# Altium schematic sheet fpga_ddr3l.SchDoc: FPGA DDR3L Memory
size A4; Organization: GPA Robotics; DocumentNumber: 4; Revision: REV 0; SheetNumber: 4; SheetTotal: 4
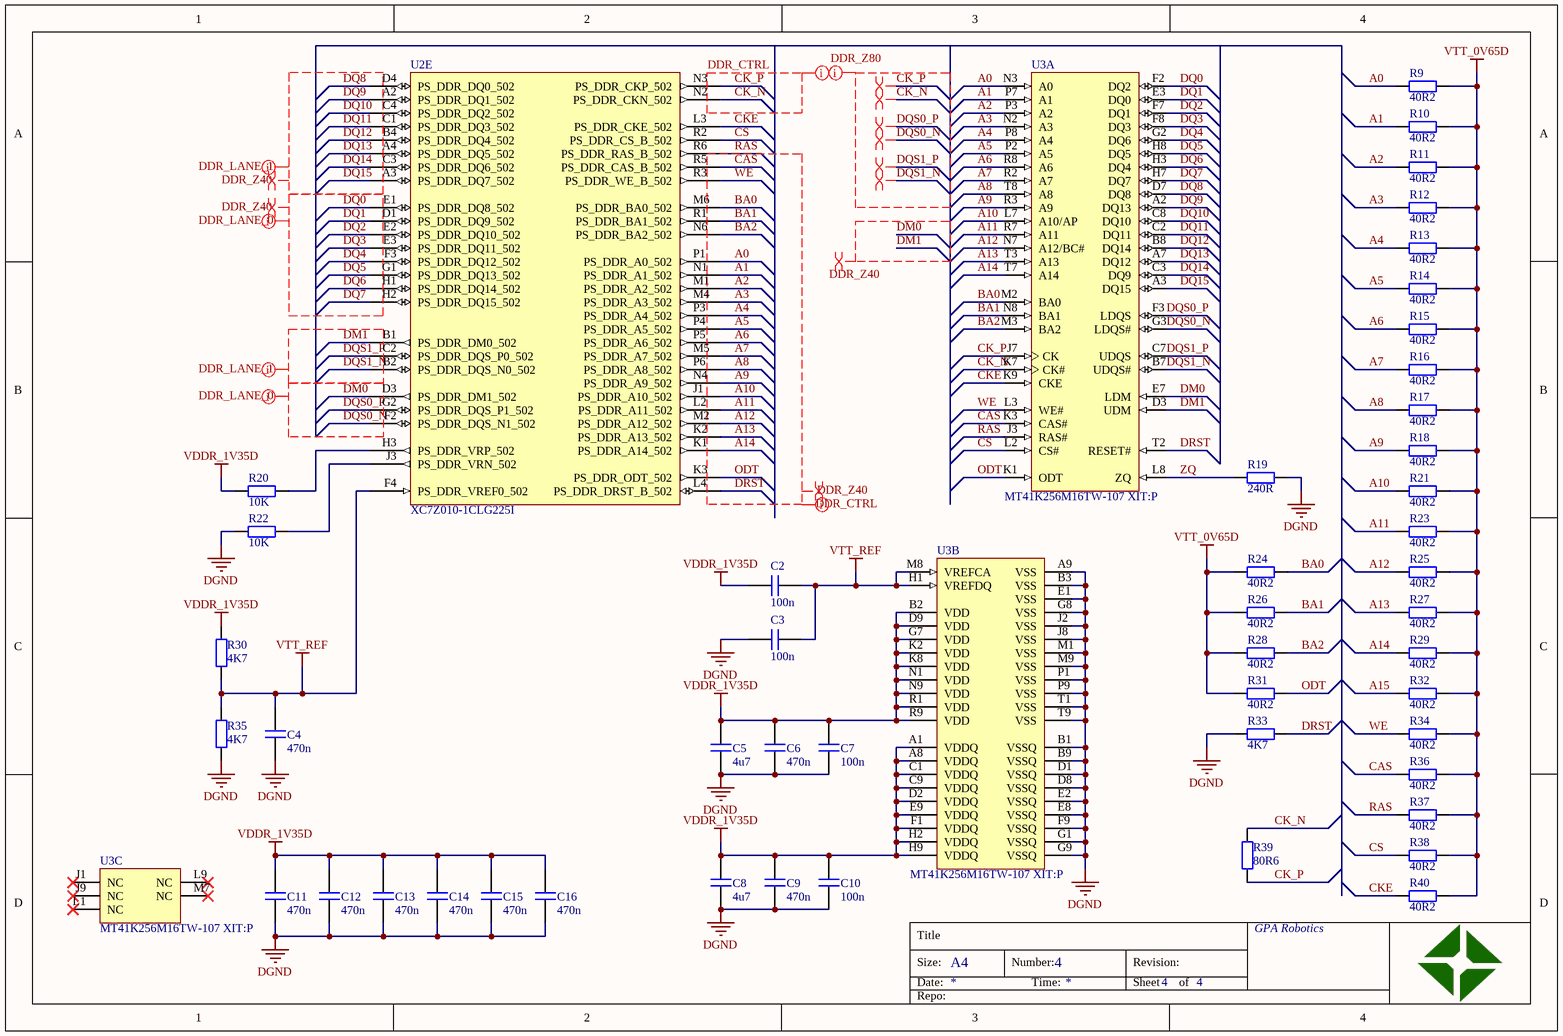
[diagram p0: fpga_ddr3l.SchDoc]

## Parts
C2  value 100n  [CAPC1005X06N]  (hidden comment: cap)
C3  value 100n  [CAPC1005X06N]  (hidden comment: cap)
C4  value 470n  [CAPC1005X06N]  (hidden comment: cap)
C5  value 4u7  [CAPC1608X08N]  (hidden comment: cap)
C6  value 470n  [CAPC1005X06N]  (hidden comment: cap)
C7  value 100n  [CAPC1005X06N]  (hidden comment: cap)
C8  value 4u7  [CAPC1608X08N]  (hidden comment: cap)
C9  value 470n  [CAPC1005X06N]  (hidden comment: cap)
C10  value 100n  [CAPC1005X06N]  (hidden comment: cap)
C11  value 470n  [CAPC1005X06N]  (hidden comment: cap)
C12  value 470n  [CAPC1005X06N]  (hidden comment: cap)
C13  value 470n  [CAPC1005X06N]  (hidden comment: cap)
C14  value 470n  [CAPC1005X06N]  (hidden comment: cap)
C15  value 470n  [CAPC1005X06N]  (hidden comment: cap)
C16  value 470n  [CAPC1005X06N]  (hidden comment: cap)
R9  value 40R2  [RESC1005X04N]  (hidden comment: res)
R10  value 40R2  [RESC1005X04N]  (hidden comment: res)
R11  value 40R2  [RESC1005X04N]  (hidden comment: res)
R12  value 40R2  [RESC1005X04N]  (hidden comment: res)
R13  value 40R2  [RESC1005X04N]  (hidden comment: res)
R14  value 40R2  [RESC1005X04N]  (hidden comment: res)
R15  value 40R2  [RESC1005X04N]  (hidden comment: res)
R16  value 40R2  [RESC1005X04N]  (hidden comment: res)
R17  value 40R2  [RESC1005X04N]  (hidden comment: res)
R18  value 40R2  [RESC1005X04N]  (hidden comment: res)
R19  value 240R  [RESC1005X04N]  (hidden comment: res)
R20  value 10K  [RESC1005X04N]  (hidden comment: res)
R21  value 40R2  [RESC1005X04N]  (hidden comment: res)
R22  value 10K  [RESC1005X04N]  (hidden comment: res)
R23  value 40R2  [RESC1005X04N]  (hidden comment: res)
R24  value 40R2  [RESC1005X04N]  (hidden comment: res)
R25  value 40R2  [RESC1005X04N]  (hidden comment: res)
R26  value 40R2  [RESC1005X04N]  (hidden comment: res)
R27  value 40R2  [RESC1005X04N]  (hidden comment: res)
R28  value 40R2  [RESC1005X04N]  (hidden comment: res)
R29  value 40R2  [RESC1005X04N]  (hidden comment: res)
R30  value 4K7  [RESC1005X04N]  (hidden comment: res)
R31  value 40R2  [RESC1005X04N]  (hidden comment: res)
R32  value 40R2  [RESC1005X04N]  (hidden comment: res)
R33  value 4K7  [RESC1005X04N]  (hidden comment: res)
R34  value 40R2  [RESC1005X04N]  (hidden comment: res)
R35  value 4K7  [RESC1005X04N]  (hidden comment: res)
R36  value 40R2  [RESC1005X04N]  (hidden comment: res)
R37  value 40R2  [RESC1005X04N]  (hidden comment: res)
R38  value 40R2  [RESC1005X04N]  (hidden comment: res)
R39  value 80R6  [RESC1005X04N]  (hidden comment: res)
R40  value 40R2  [RESC1005X04N]  (hidden comment: res)
U2  XC7Z010-1CLG225I  [CLG225]  (part E of 8)
U3  MT41K256M16TW-107 XIT:P  [MICT-TW-96]  (parts A,B,C of 3)

## Nets
DGND: C3.1 C4.1 C5.1 C6.1 C7.1 C8.1 C9.1 C10.1 C11.1 C12.1 C13.1 C14.1 C15.1 C16.1 R19.2 R22.1 R33.2 R35.1 U3.A9(VSS) U3.B1(VSSQ) U3.B3(VSS) U3.B9(VSSQ) U3.D1(VSSQ) U3.D8(VSSQ) U3.E1(VSS) U3.E2(VSSQ) U3.E8(VSSQ) U3.F9(VSSQ) U3.G1(VSSQ) U3.G8(VSS) U3.G9(VSSQ) U3.J2(VSS) U3.J8(VSS) U3.M1(VSS) U3.M9(VSS) U3.P1(VSS) U3.P9(VSS) U3.T1(VSS) U3.T9(VSS)
VDDR_1V35D: C2.1 C5.2 C6.2 C7.2 C8.2 C9.2 C10.2 C11.2 C12.2 C13.2 C14.2 C15.2 C16.2 R20.1 R30.2 U3.A1(VDDQ) U3.A8(VDDQ) U3.B2(VDD) U3.C1(VDDQ) U3.C9(VDDQ) U3.D2(VDDQ) U3.D9(VDD) U3.E9(VDDQ) U3.F1(VDDQ) U3.G7(VDD) U3.H2(VDDQ) U3.H9(VDDQ) U3.K2(VDD) U3.K8(VDD) U3.N1(VDD) U3.N9(VDD) U3.R1(VDD) U3.R9(VDD)
VTT_0V65D: R9.2 R10.2 R11.2 R12.2 R13.2 R14.2 R15.2 R16.2 R17.2 R18.2 R21.2 R23.2 R24.2 R25.2 R26.2 R27.2 R28.2 R29.2 R31.2 R32.2 R34.2 R36.2 R37.2 R38.2 R40.2
VTT_REF: C2.2 C3.2 C4.2 R30.1 R35.2 U2.F4(PS_DDR_VREF0_502) U3.H1(VREFDQ) U3.M8(VREFCA)
A0: R9.1 U2.P1(PS_DDR_A0_502) U3.N3(A0)
A1: R10.1 U2.N1(PS_DDR_A1_502) U3.P7(A1)
A2: R11.1 U2.M1(PS_DDR_A2_502) U3.P3(A2)
A3: R12.1 U2.M4(PS_DDR_A3_502) U3.N2(A3)
A4: R13.1 U2.P3(PS_DDR_A4_502) U3.P8(A4)
A5: R14.1 U2.P4(PS_DDR_A5_502) U3.P2(A5)
A6: R15.1 U2.P5(PS_DDR_A6_502) U3.R8(A6)
A7: R16.1 U2.M5(PS_DDR_A7_502) U3.R2(A7)
A8: R17.1 U2.P6(PS_DDR_A8_502) U3.T8(A8)
A9: R18.1 U2.N4(PS_DDR_A9_502) U3.R3(A9)
A10: R21.1 U2.J1(PS_DDR_A10_502) U3.L7(A10/AP)
A11: R23.1 U2.L2(PS_DDR_A11_502) U3.R7(A11)
A12: R25.1 U2.M2(PS_DDR_A12_502) U3.N7(A12/BC#)
A13: R27.1 U2.K2(PS_DDR_A13_502) U3.T3(A13)
A14: R29.1 U2.K1(PS_DDR_A14_502) U3.T7(A14)
A15: R32.1
BA0: R24.1 U2.M6(PS_DDR_BA0_502) U3.M2(BA0)
BA1: R26.1 U2.R1(PS_DDR_BA1_502) U3.N8(BA1)
BA2: R28.1 U2.N6(PS_DDR_BA2_502) U3.M3(BA2)
CAS: R36.1 U2.R5(PS_DDR_CAS_B_502) U3.K3(CAS#)
CK_N: R39.1 U2.N2(PS_DDR_CKN_502) U3.K7(CK#)
CK_P: R39.2 U2.N3(PS_DDR_CKP_502) U3.J7(CK)
CKE: R40.1 U2.L3(PS_DDR_CKE_502) U3.K9(CKE)
CS: R38.1 U2.R2(PS_DDR_CS_B_502) U3.L2(CS#)
DM0: U2.D3(PS_DDR_DM1_502) U3.E7(LDM)
DM1: U2.B1(PS_DDR_DM0_502) U3.D3(UDM)
DQ0: U2.E1(PS_DDR_DQ8_502) U3.F2(DQ2)
DQ1: U2.D1(PS_DDR_DQ9_502) U3.E3(DQ0)
DQ2: U2.E2(PS_DDR_DQ10_502) U3.F7(DQ1)
DQ3: U2.E3(PS_DDR_DQ11_502) U3.F8(DQ3)
DQ4: U2.F3(PS_DDR_DQ12_502) U3.G2(DQ6)
DQ5: U2.G1(PS_DDR_DQ13_502) U3.H8(DQ5)
DQ6: U2.H1(PS_DDR_DQ14_502) U3.H3(DQ4)
DQ7: U2.H2(PS_DDR_DQ15_502) U3.H7(DQ7)
DQ8: U2.D4(PS_DDR_DQ0_502) U3.D7(DQ8)
DQ9: U2.A2(PS_DDR_DQ1_502) U3.A2(DQ13)
DQ10: U2.C4(PS_DDR_DQ2_502) U3.C8(DQ10)
DQ11: U2.C1(PS_DDR_DQ3_502) U3.C2(DQ11)
DQ12: U2.B4(PS_DDR_DQ4_502) U3.B8(DQ14)
DQ13: U2.A4(PS_DDR_DQ5_502) U3.A7(DQ12)
DQ14: U2.C3(PS_DDR_DQ6_502) U3.C3(DQ9)
DQ15: U2.A3(PS_DDR_DQ7_502) U3.A3(DQ15)
DQS0_N: U2.F2(PS_DDR_DQS_N1_502) U3.G3(LDQS#)
DQS0_P: U2.G2(PS_DDR_DQS_P1_502) U3.F3(LDQS)
DQS1_N: U2.B2(PS_DDR_DQS_N0_502) U3.B7(UDQS#)
DQS1_P: U2.C2(PS_DDR_DQS_P0_502) U3.C7(UDQS)
DRST: R33.1 U2.L4(PS_DDR_DRST_B_502) U3.T2(RESET#)
ODT: R31.1 U2.K3(PS_DDR_ODT_502) U3.K1(ODT)
RAS: R37.1 U2.R6(PS_DDR_RAS_B_502) U3.J3(RAS#)
WE: R34.1 U2.R3(PS_DDR_WE_B_502) U3.L3(WE#)
ZQ: R19.1 U3.L8(ZQ)
NetR20_2: R20.2 U2.H3(PS_DDR_VRP_502)
NetR22_2: R22.2 U2.J3(PS_DDR_VRN_502)

Not connected (* = marked no-connect by the designer): U3 J1(NC)* J9(NC)* L1(NC)* L9(NC)* M7(NC)*

## Layout directives
net class DDR_CTRL: A0, A1, A2, A3, A4, A5, A6, A7, A8, A9, A10, A11, A12, A13, A14, BA0, BA1, BA2, CAS, CK_N, CK_P, DRST, ODT, RAS, WE
net class DDR_LANE_1; rule Matched Net Lengths [Delay Tolerance = 15ps]: DM1, DQ8, DQ9, DQ10, DQ11, DQ12, DQ13, DQ14, DQ15, DQS1_N, DQS1_P
net class DDR_LANE_0; rule Matched Net Lengths [Delay Tolerance = 15ps]: DM0, DQ0, DQ1, DQ2, DQ3, DQ4, DQ5, DQ6, DQ7, DQS0_N, DQS0_P
net class DDR_Z40: A0, A1, A2, A3, A4, A5, A6, A7, A8, A9, A10, A11, A12, A13, A14, BA0, BA1, BA2, CAS, DM0, DM1, DQ0, DQ1, DQ2, DQ3, DQ4, DQ5, DQ6, DQ7, DQ8, DQ9, DQ10, DQ11, DQ12, DQ13, DQ14, DQ15, DRST, ODT, RAS, WE
differential pair: CK_N, CK_P, DQS0_N, DQS0_P, DQS1_N, DQS1_P
net class DDR_Z80; rule Matched Net Lengths [Tolerance = 5mil]: CK_N, CK_P, DQS0_N, DQS0_P, DQS1_N, DQS1_P

## Notes on the sheet
- Title
- Size:
- Date:
- A4
- Number:
- Time:
- Revision:
- Sheet
- of
- Repo:

## Library data of the parts
C2-C16 = cap: Capacitor; voltage: *; type: *; #digikey: *; #mouser: *
R9-R40 = res: Resistor; power: *; voltage: *; #digikey: *; #mouser: *
U2 = CMP-0382-00001-1: 667 MHz Zynq™-7000 AP SoC, 88 PS I/O, 54 FPGA I/O, 225-Ball BGA, Speed Grade 1, Industrial Grade, Pb-Free; LUTs: 17600; Extensible Block RAM (# 36Kb Blocks): 240 KB (60); Speed Grade: -1; Flip Flops: 35200; DatasheetVersion: v1.2; ComponentLink4Description: Package File; ComponentLink1URL: http://www.xilinx.com/support/documentation/data_sheets/ds190-Zynq-7000-Overview.pdf; ComponentLink5URL: http://www.xilinx.com/support/documentation/user_guides/ug865-Zynq-7000-Pkg-Pinout.pdf; ComponentLink5Description: Packaging and Pinout; PartNumber: XC7Z010-1CLG225I; PackageVersion: Rev 1.2, 02/2013; ComponentLink3Description: DC and AC Switching Characteristics; ComponentLink2URL: http://www.xilinx.com/support/documentation/user_guides/ug865-Zynq-7000-Pkg-Pinout.pdf; ComponentLink3URL: http://www.xilinx.com/support/documentation/data_sheets/ds187-XC7Z010-XC7Z020-Data-Sheet.pdf; ComponentLink6URL: http://www.xilinx.com/support/documentation/user_guides/ug483_7Series_PCB.pdf; ComponentLink2Description: Package Specification; PackageReference: CLG225; ComponentLink1Description: Datasheet; ComponentLink4URL: http://www.xilinx.com/support/packagefiles/z7packages/xc7z010clg225pkg.txt; Generic Part Number: XC7Z010; ComponentLink6Description: PCB and Layout Guide; Mounting Technology: Surface Mount; PackageDescription: Wire-Bond Chip-Scale BGA, Body 13 x 13 mm, 0.8 mm Pitch; Code_JEDEC: MO-275-HHAC-1; RoHS: Pb-Free
U3 = CMP-2000-07474-1: DDR3L SDRAM, 4 GB, 933 MHz, 1.283 to 1.45 V, -40 to 95 degC, 96-Pin FBGA, RoHs, Tray; Manufacturer: Micron; Density: 4Gb; Interface: Parallel; Access Time: 1.07ns; Data Bus Width: 16b; Case\/Package: TFBGA; Address Bus Width: 15b; Frequency: 933MHz; Memory Type: RAM; Contact Plating: Silver; RoHSCompliant: true; Datasheet URL: https://www.micron.com/~/media/documents/products/data-sheet/dram/ddr3/4gb_1_35v_ddr3l_xit_addendum.pdf; Manufacturer URL: http://www.micron.com/; Mount: SurfaceMount; Max Operating Temperature: 95degC; Datasheet Version: Rev. A, 02/2016; Min Operating Temperature: -40degC; Packaging: Tray; Mounting Technology: SurfaceMount; Max Frequency: 933MHz; Package Reference: TW-96; Package Description: 96-Ball Fine Pitch Ball Grid Array, Body 14 x 8 mm, Pitch 0.8 mm